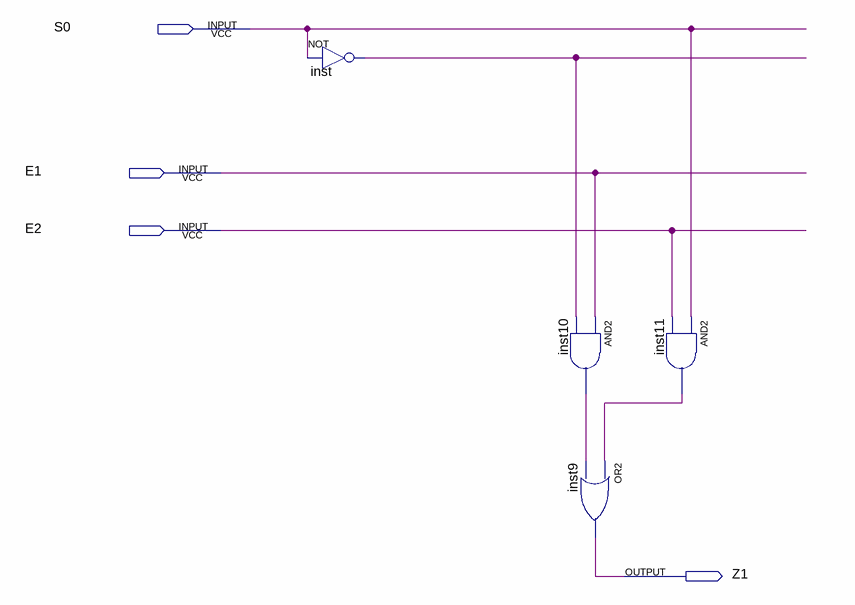
[diagram p0: schematic sheet]
// Quartus schematic muxAux2.bdf as structural Verilog: 4 symbols, 4 pins
module muxAux2 (
  input  S0,
  input  E1,
  input  E2,
  output Z1
);

  wire inst10_out, inst11_out, inst_out;

  not inst (inst_out, S0);
  and inst10 (inst10_out, E1, inst_out);
  or inst9 (Z1, inst11_out, inst10_out);
  and inst11 (inst11_out, S0, E2);
endmodule
